# Altium project USRP2_Clone.PrjPcb (part 3 of 4)

## Sheet DB.SchDoc: {Наименование}
size 420 x 297 mm; DocumentNumber: ПЛАС.ХХХХХХ.ХХХ ХХ; SheetNumber: 7; SheetTotal: 11; PageSetup: Record=PageOptions|CenterHorizontal=False|CenterVertical=False|PrintScale=0.95|XCorrection=0.00|YCorrection=0.00|PrintKind=1|BorderSize=5000000|LeftOffset=0|BottomOffset=0|Orientation=1|PaperLength=1000|PaperWidth=1000|Scale=100|PaperSource=15|PrintQuality=600|MediaType=1|DitherType=10|PaperKind=A4|PrintScaleMode=1; Rule: PcbType=ProtelPcb
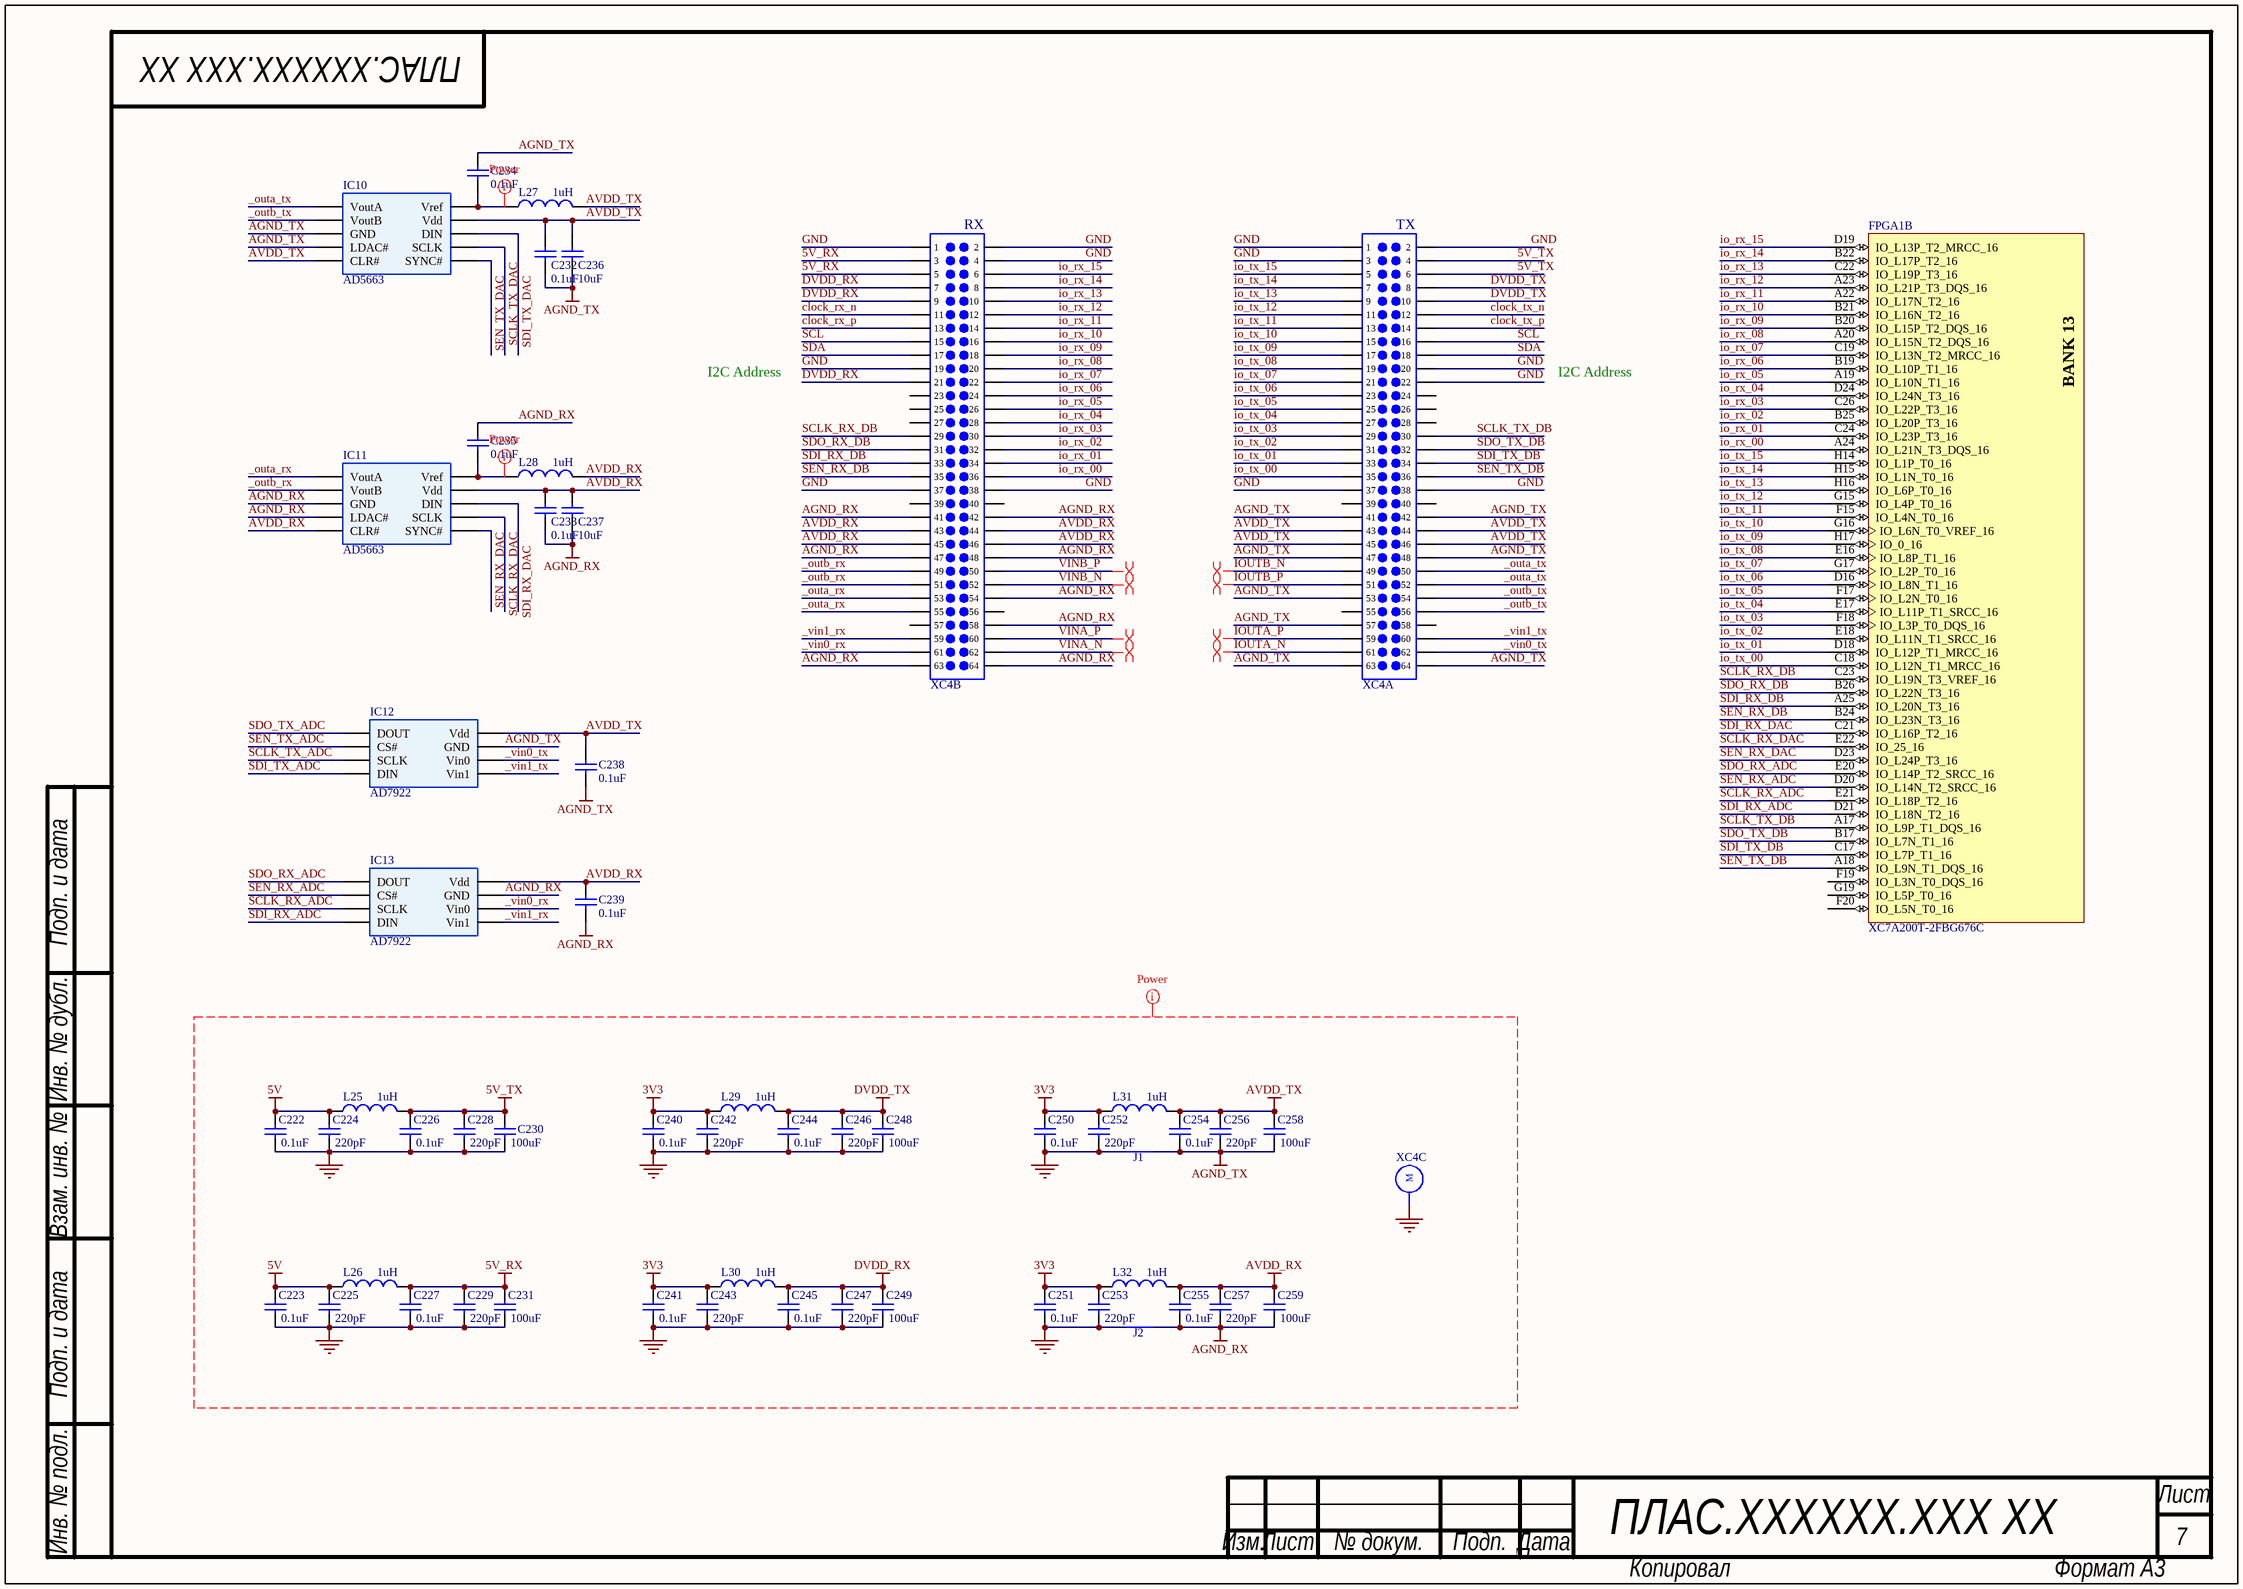
[diagram p6: DB.SchDoc]

### Parts
C222  value 0.1uF  [C0603]  (hidden comment: Cap)
C223  value 0.1uF  [C0603]  (hidden comment: Cap)
C224  value 220pF  [C0603]  (hidden comment: Cap)
C225  value 220pF  [C0603]  (hidden comment: Cap)
C226  value 0.1uF  [C0603]  (hidden comment: Cap)
C227  value 0.1uF  [C0603]  (hidden comment: Cap)
C228  value 220pF  [C0603]  (hidden comment: Cap)
C229  value 220pF  [C0603]  (hidden comment: Cap)
C230  value 100uF  [C1210]  (hidden comment: Cap)
C231  value 100uF  [C1210]  (hidden comment: Cap)
C232  value 0.1uF  [C0603]  (hidden comment: Cap)
C233  value 0.1uF  [C0603]  (hidden comment: Cap)
C234  value 0.1uF  [C0603]  (hidden comment: Cap)
C235  value 0.1uF  [C0603]  (hidden comment: Cap)
C236  value 10uF  [C0603]  (hidden comment: Cap)
C237  value 10uF  [C0603]  (hidden comment: Cap)
C238  value 0.1uF  [C0603]  (hidden comment: Cap)
C239  value 0.1uF  [C0603]  (hidden comment: Cap)
C240  value 0.1uF  [C0603]  (hidden comment: Cap)
C241  value 0.1uF  [C0603]  (hidden comment: Cap)
C242  value 220pF  [C0603]  (hidden comment: Cap)
C243  value 220pF  [C0603]  (hidden comment: Cap)
C244  value 0.1uF  [C0603]  (hidden comment: Cap)
C245  value 0.1uF  [C0603]  (hidden comment: Cap)
C246  value 220pF  [C0603]  (hidden comment: Cap)
C247  value 220pF  [C0603]  (hidden comment: Cap)
C248  value 100uF  [C1210]  (hidden comment: Cap)
C249  value 100uF  [C1210]  (hidden comment: Cap)
C250  value 0.1uF  [C0603]  (hidden comment: Cap)
C251  value 0.1uF  [C0603]  (hidden comment: Cap)
C252  value 220pF  [C0603]  (hidden comment: Cap)
C253  value 220pF  [C0603]  (hidden comment: Cap)
C254  value 0.1uF  [C0603]  (hidden comment: Cap)
C255  value 0.1uF  [C0603]  (hidden comment: Cap)
C256  value 220pF  [C0603]  (hidden comment: Cap)
C257  value 220pF  [C0603]  (hidden comment: Cap)
C258  value 100uF  [C1210]  (hidden comment: Cap)
C259  value 100uF  [C1210]  (hidden comment: Cap)
FPGA1  XC7A200T-2FBG676C  [FGG676]  (part B of 14)
IC10  AD5663  [MSOP-10]
IC11  AD5663  [MSOP-10]
IC12  AD7922  [MSOP-8]
IC13  AD7922  [MSOP-8]
J1  JMP  [JUMPER]  (value not drawn)  (net tie, no BOM)
J2  JMP  [JUMPER]  (value not drawn)  (net tie, no BOM)
L25  value 1uH  [L1210_Murata LQH]  (hidden comment: Inductor_LF)
L26  value 1uH  [L1210_Murata LQH]  (hidden comment: Inductor_LF)
L27  value 1uH  [L1206_Murata]  (hidden comment: Inductor_LF)
L28  value 1uH  [L1206_Murata]  (hidden comment: Inductor_LF)
L29  value 1uH  [L1210_Murata LQH]  (hidden comment: Inductor_LF)
L30  value 1uH  [L1210_Murata LQH]  (hidden comment: Inductor_LF)
L31  value 1uH  [L1210_Murata LQH]  (hidden comment: Inductor_LF)
L32  value 1uH  [L1210_Murata LQH]  (hidden comment: Inductor_LF)
XC4  64-pin Male Mezzanine  [RFX]  (value not drawn)  (parts A,B,C of 3)

### Nets
3V3: C240.1 C241.1 C242.1 C243.1 C250.1 C251.1 C252.1 C253.1 L29.2 L30.2 L31.1 L32.1
5V: C222.1 C223.1 C224.1 C225.1 L25.1 L26.2
5V_RX: C227.1 C229.1 C231.1 L26.1 XC4.67(3) XC4.69(5)
5V_TX: C226.1 C228.1 C230.1 L25.2 XC4.4 XC4.6
AGND_RX: C233.2 C235.1 C237.2 C239.2 C255.2 C257.2 C259.2 IC11.3(GND) IC11.4(LDAC#) IC13.7(GND) J2.2 XC4.105(41) XC4.106(42) XC4.111(47) XC4.112(48) XC4.118(54) XC4.122(58) XC4.127(63) XC4.128(64)
AGND_TX: C232.2 C234.1 C236.2 C238.1 C254.2 C256.2 C258.2 IC10.3(GND) IC10.4(LDAC#) IC12.7(GND) J1.2 XC4.41 XC4.42 XC4.47 XC4.48 XC4.53 XC4.57 XC4.63 XC4.64
AVDD_RX: C233.1 C237.1 C239.1 C255.1 C257.1 C259.1 IC11.5(CLR#) IC11.9(Vdd) IC13.8(Vdd) L28.1 L32.2 XC4.107(43) XC4.108(44) XC4.109(45) XC4.110(46)
AVDD_TX: C232.1 C236.1 C238.2 C254.1 C256.1 C258.1 IC10.5(CLR#) IC10.9(Vdd) IC12.8(Vdd) L27.1 L31.2 XC4.43 XC4.44 XC4.45 XC4.46
DVDD_RX: C245.1 C247.1 C249.1 L30.1 XC4.71(7) XC4.73(9) XC4.85(21)
DVDD_TX: C244.1 C246.1 C248.1 L29.1 XC4.8 XC4.10
GND: C222.2 C223.2 C224.2 C225.2 C226.2 C227.2 C228.2 C229.2 C230.2 C231.2 C240.2 C241.2 C242.2 C243.2 C244.2 C245.2 C246.2 C247.2 C248.2 C249.2 C250.2 C251.2 C252.2 C253.2 J1.1 J2.1 XC4.0(M) XC4.1 XC4.2 XC4.3 XC4.20 XC4.22 XC4.37 XC4.38 XC4.65(1) XC4.66(2) XC4.68(4) XC4.83(19) XC4.101(37) XC4.102(38)
_outa_rx: IC11.1(VoutA) XC4.117(53) XC4.119(55)
_outa_tx: IC10.1(VoutA) XC4.50 XC4.52
_outb_rx: IC11.2(VoutB) XC4.113(49) XC4.115(51)
_outb_tx: IC10.2(VoutB) XC4.54 XC4.56
_vin0_rx: IC13.6(Vin0) XC4.125(61)
_vin0_tx: IC12.6(Vin0) XC4.62
_vin1_rx: IC13.5(Vin1) XC4.123(59)
_vin1_tx: IC12.5(Vin1) XC4.60
clock_rx_n: XC4.75(11)
clock_rx_p: XC4.77(13)
clock_tx_n: XC4.12
clock_tx_p: XC4.14
io_rx_00: FPGA1.A24(IO_L21N_T3_DQS_16) XC4.100(36)
io_rx_01: FPGA1.C24(IO_L23P_T3_16) XC4.98(34)
io_rx_02: FPGA1.B25(IO_L20P_T3_16) XC4.96(32)
io_rx_03: FPGA1.C26(IO_L22P_T3_16) XC4.94(30)
io_rx_04: FPGA1.D24(IO_L24N_T3_16) XC4.92(28)
io_rx_05: FPGA1.A19(IO_L10N_T1_16) XC4.90(26)
io_rx_06: FPGA1.B19(IO_L10P_T1_16) XC4.88(24)
io_rx_07: FPGA1.C19(IO_L13N_T2_MRCC_16) XC4.86(22)
io_rx_08: FPGA1.A20(IO_L15N_T2_DQS_16) XC4.84(20)
io_rx_09: FPGA1.B20(IO_L15P_T2_DQS_16) XC4.82(18)
io_rx_10: FPGA1.B21(IO_L16N_T2_16) XC4.80(16)
io_rx_11: FPGA1.A22(IO_L17N_T2_16) XC4.78(14)
io_rx_12: FPGA1.A23(IO_L21P_T3_DQS_16) XC4.76(12)
io_rx_13: FPGA1.C22(IO_L19P_T3_16) XC4.74(10)
io_rx_14: FPGA1.B22(IO_L17P_T2_16) XC4.72(8)
io_rx_15: FPGA1.D19(IO_L13P_T2_MRCC_16) XC4.70(6)
io_tx_00: FPGA1.C18(IO_L12N_T1_MRCC_16) XC4.35
io_tx_01: FPGA1.D18(IO_L12P_T1_MRCC_16) XC4.33
io_tx_02: FPGA1.E18(IO_L11N_T1_SRCC_16) XC4.31
io_tx_03: FPGA1.F18(IO_L3P_T0_DQS_16) XC4.29
io_tx_04: FPGA1.E17(IO_L11P_T1_SRCC_16) XC4.27
io_tx_05: FPGA1.F17(IO_L2N_T0_16) XC4.25
io_tx_06: FPGA1.D16(IO_L8N_T1_16) XC4.23
io_tx_07: FPGA1.G17(IO_L2P_T0_16) XC4.21
io_tx_08: FPGA1.E16(IO_L8P_T1_16) XC4.19
io_tx_09: FPGA1.H17(IO_0_16) XC4.17
io_tx_10: FPGA1.G16(IO_L6N_T0_VREF_16) XC4.15
io_tx_11: FPGA1.F15(IO_L4N_T0_16) XC4.13
io_tx_12: FPGA1.G15(IO_L4P_T0_16) XC4.11
io_tx_13: FPGA1.H16(IO_L6P_T0_16) XC4.9
io_tx_14: FPGA1.H15(IO_L1N_T0_16) XC4.7
io_tx_15: FPGA1.H14(IO_L1P_T0_16) XC4.5
IOUTA_N: XC4.61
IOUTA_P: XC4.59
IOUTB_N: XC4.49
IOUTB_P: XC4.51
SCL: XC4.16 XC4.79(15)
SCLK_RX_ADC: FPGA1.E21(IO_L18P_T2_16) IC13.3(SCLK)
SCLK_RX_DAC: FPGA1.E22(IO_25_16) IC11.7(SCLK)
SCLK_RX_DB: FPGA1.C23(IO_L19N_T3_VREF_16) XC4.93(29)
SCLK_TX_ADC: IC12.3(SCLK)
SCLK_TX_DAC: IC10.7(SCLK)
SCLK_TX_DB: FPGA1.A17(IO_L9P_T1_DQS_16) XC4.30
SDA: XC4.18 XC4.81(17)
SDI_RX_ADC: FPGA1.D21(IO_L18N_T2_16) IC13.4(DIN)
SDI_RX_DAC: FPGA1.C21(IO_L16P_T2_16) IC11.8(DIN)
SDI_RX_DB: FPGA1.A25(IO_L20N_T3_16) XC4.97(33)
SDI_TX_ADC: IC12.4(DIN)
SDI_TX_DAC: IC10.8(DIN)
SDI_TX_DB: FPGA1.C17(IO_L7P_T1_16) XC4.34
SDO_RX_ADC: FPGA1.E20(IO_L14P_T2_SRCC_16) IC13.1(DOUT)
SDO_RX_DB: FPGA1.B26(IO_L22N_T3_16) XC4.95(31)
SDO_TX_ADC: IC12.1(DOUT)
SDO_TX_DB: FPGA1.B17(IO_L7N_T1_16) XC4.32
SEN_RX_ADC: FPGA1.D20(IO_L14N_T2_SRCC_16) IC13.2(CS#)
SEN_RX_DAC: FPGA1.D23(IO_L24P_T3_16) IC11.6(SYNC#)
SEN_RX_DB: FPGA1.B24(IO_L23N_T3_16) XC4.99(35)
SEN_TX_ADC: IC12.2(CS#)
SEN_TX_DAC: IC10.6(SYNC#)
SEN_TX_DB: FPGA1.A18(IO_L9N_T1_DQS_16) XC4.36
VINA_N: XC4.126(62)
VINA_P: XC4.124(60)
VINB_N: XC4.116(52)
VINB_P: XC4.114(50)
NetC234_2: C234.2 IC10.10(Vref) L27.2
NetC235_2: C235.2 IC11.10(Vref) L28.2

Not connected (* = marked no-connect by the designer): FPGA1 F19(IO_L3N_T0_DQS_16) F20(IO_L5N_T0_16) G19(IO_L5P_T0_16); XC4 24 26 28 39 40 55 58 87(23) 89(25) 91(27) 103(39) 104(40) 120(56) 121(57)

### Layout directives
net class Power: 3V3, 5V, 5V_RX, 5V_TX, AGND_RX, AGND_TX, AVDD_RX, AVDD_TX, DVDD_RX, DVDD_TX, GND, NetC234_2, NetC235_2
differential pair: IOUTA_N, IOUTA_P, IOUTB_N, IOUTB_P, VINA_N, VINA_P, VINB_N, VINB_P

### Notes on the sheet
- I2C Address
- Подп. и дата
- Инв. № дубл.
- Взам. инв. №
- Инв. № подл.
- Лист
- Изм.
- № докум.
- Подп.
- Дата
- Копировал
- Формат А3
- (in symbol RFX, part A) TX
- (in symbol RFX, part B) RX
- (in symbol XC7A200T-2FBG676C, part B) BANK 13

### Library data of the parts
C222-C229 C232-C235 C238-C247 C250-C257 = Cer Cap: as C263 on sheet Clocking; PackageReference: SMD Chip Capacitor; Package: 0603
C230 C231 C248 C249 C258 C259 = Cap uF: as C295 on sheet Clocking; Package: C1210; PackageDescription: SMD Chip Capacitor
C236 C237 = Cer Cap: Cer Cap Small; Manufacturer: Murata; Material: x5r; Voltage: 6.3V; Tolerance: 10%; Type: Ceramic; PackageReference: SMD Chip Capacitor; Package: 0603
FPGA1 = XC7A200T-2FBG676C: as FPGA1 on sheet JTAG; DatasheetVersion: v1.12; PackageVersion: Rev 1.8; PackageReference: FBG676; PackageDescription: Flip-Chip Lidless BGA, Body 27 x 27 mm, 1.0 mm Pitch; Supplier 1: Digi-Key; Supplier Part Number 1: 122-1865-ND; CLBs (Max Distributed RAM Kb): 2888; Generic Part Number: XC7A200T; RoHS: Pb-Free; NexusDeviceID: XC7A200T-2FBG676C; Mounting Technology: Surface Mount; Code_JEDEC: MS-034; PartNumber: XC7A200T-2FBG676C; ComponentLink1Description: Manufacturer URL; ComponentLink1URL: http://www.xilinx.com/; ComponentLink2Description: Datasheet; ComponentLink2URL: http://www.xilinx.com/support/documentation/data_sheets/ds180_7Series_Overview.pdf; ComponentLink3Description: Package Specification; ComponentLink3URL: http://www.xilinx.com/support/documentation/user_guides/ug475_7Series_Pkg_Pinout.pdf; ComponentLink4Description: DC and Switching Characteristics; ComponentLink4URL: http://www.xilinx.com/support/documentation/data_sheets/ds181_Artix_7_Data_Sheet.pdf; ComponentLink5Description: Package File; ComponentLink5URL: http://www.xilinx.com/support/packagefiles/a7packages/xc7a200tfbg676pkg.txt; ComponentLink6Description: Packaging and Pinout; ComponentLink6URL: http://www.xilinx.com/support/documentation/user_guides/ug475_7Series_Pkg_Pinout.pdf
IC10 IC11 = AD56x3R: Dual 12-/14-/16-Bit nanoDAC; Manufacturer: Analog Device; Name: AD5663RBRMZ-5; settling time: 4.5 μs maximum; Voltage: 2.7 V to 5.5 V; High speed serial interface: SPI®/QSPI™/MICROWIRE™/DSP compatible; Type: Dual 12-/14-/16-Bit nanoDAC with 5 ppm/°C On-Chip Reference; Package: MSOP-10
IC12 IC13 = AD79x2: 1 MSPS, 10-/12-Bit ADC; Manufacturer: Analog Device; Name: AD7922ARM; Fast throughput rate: 1MHz; Voltage: 2.35 V to 5.25 V; High speed serial interface: SPI®/QSPI™/MICROWIRE™/DSP compatible; Type: 2-Channel, 2.35 V to 5.25 V,1 MSPS, 10-/12-Bit ADC; Package: MSOP-8
J1 J2 = JMP: PGND & AGND Connect; Rule: UNIONINDEX{}0[]RULEKIND{}Width[]NETSCOPE{}AnyNet[]LAYERKIND{}SameLayer[]NAME{}Schematic Width Constraint[]MAXLIMIT{}59.0551mil[]MINLIMIT{}10mil[]PREFEREDWIDTH{}10mil[]MIDLAYER5_MAXWIDTH{}19.685mil[]MIDLAYER6_MAXWIDTH{}19.685mil[]MIDLAYER7_MAXWIDTH{}19.685mil[]MIDLAYER8_MAXWIDTH{}19.685mil[]MIDLAYER9_MAXWIDTH{}19.685mil[]MIDLAYER10_MAXWIDTH{}19.685mil[]MIDLAYER11_MAXWIDTH{}19.685mil[]MIDLAYER12_MAXWIDTH{}19.685mil[]MIDLAYER13_MAXWIDTH{}19.685mil[]MIDLAYER14_MAXWIDTH{}19.685mil[]MIDLAYER15_MAXWIDTH{}19.685mil[]MIDLAYER16_MAXWIDTH{}19.685mil[]MIDLAYER17_MAXWIDTH{}19.685mil[]MIDLAYER18_MAXWIDTH{}19.685mil[]MIDLAYER19_MAXWIDTH{}19.685mil[]MIDLAYER20_MAXWIDTH{}19.685mil[]MIDLAYER21_MAXWIDTH{}19.685mil[]MIDLAYER22_MAXWIDTH{}19.685mil[]MIDLAYER23_MAXWIDTH{}19.685mil[]MIDLAYER24_MAXWIDTH{}19.685mil[]MIDLAYER25_MAXWIDTH{}19.685mil[]MIDLAYER26_MAXWIDTH{}19.685mil[]MIDLAYER27_MAXWIDTH{}19.685mil[]MIDLAYER28_MAXWIDTH{}19.685mil[]MIDLAYER29_MAXWIDTH{}19.685mil[]MIDLAYER30_MAXWIDTH{}19.685mil[]MINIMP{}50.000000[]MAXIMP{}50.000000[]FAVIMP{}50.000000[]UNIT{}Metric[]PcbType{}ProtelPcb
L25 L26 L29-L32 = Inductor_LF: Inductor_Power_Lines; Manufacturer: Murata; Name: LQH32PN1R0NNC; Tolerance: 5%; Current: 2500mA; Frequency: 100MHz; Package: 1210; PackageDescription: Chip Inductor; Temperature Range: -25…85; Series: LQH
L27 L28 = Inductor_LF: Inductor_Power_Lines; Manufacturer: Murata; Name: LQM31PN1R0M00; Tolerance: 5%; Current: 1200mA; Frequency: 60MHz; Package: 1206; PackageDescription: Chip Inductor; Temperature Range: -25…85; Series: LQM
XC4 = RFX: Name: 1.00mm Pitch Mezzanine 714362164

## Sheet FPGA&CODECS.SchDoc: {Наименование}
size 420 x 297 mm; DocumentNumber: ПЛАС.ХХХХХХ.ХХХ ХХ; SheetNumber: 8; SheetTotal: 11; PageSetup: Record=PageOptions|CenterHorizontal=False|CenterVertical=False|PrintScale=0.95|XCorrection=0.00|YCorrection=0.00|PrintKind=1|BorderSize=5000000|LeftOffset=0|BottomOffset=0|Orientation=1|PaperLength=1000|PaperWidth=1000|Scale=100|PaperSource=15|PrintQuality=600|MediaType=1|DitherType=10|PaperKind=A4|PrintScaleMode=1; Rule: PcbType=ProtelPcb
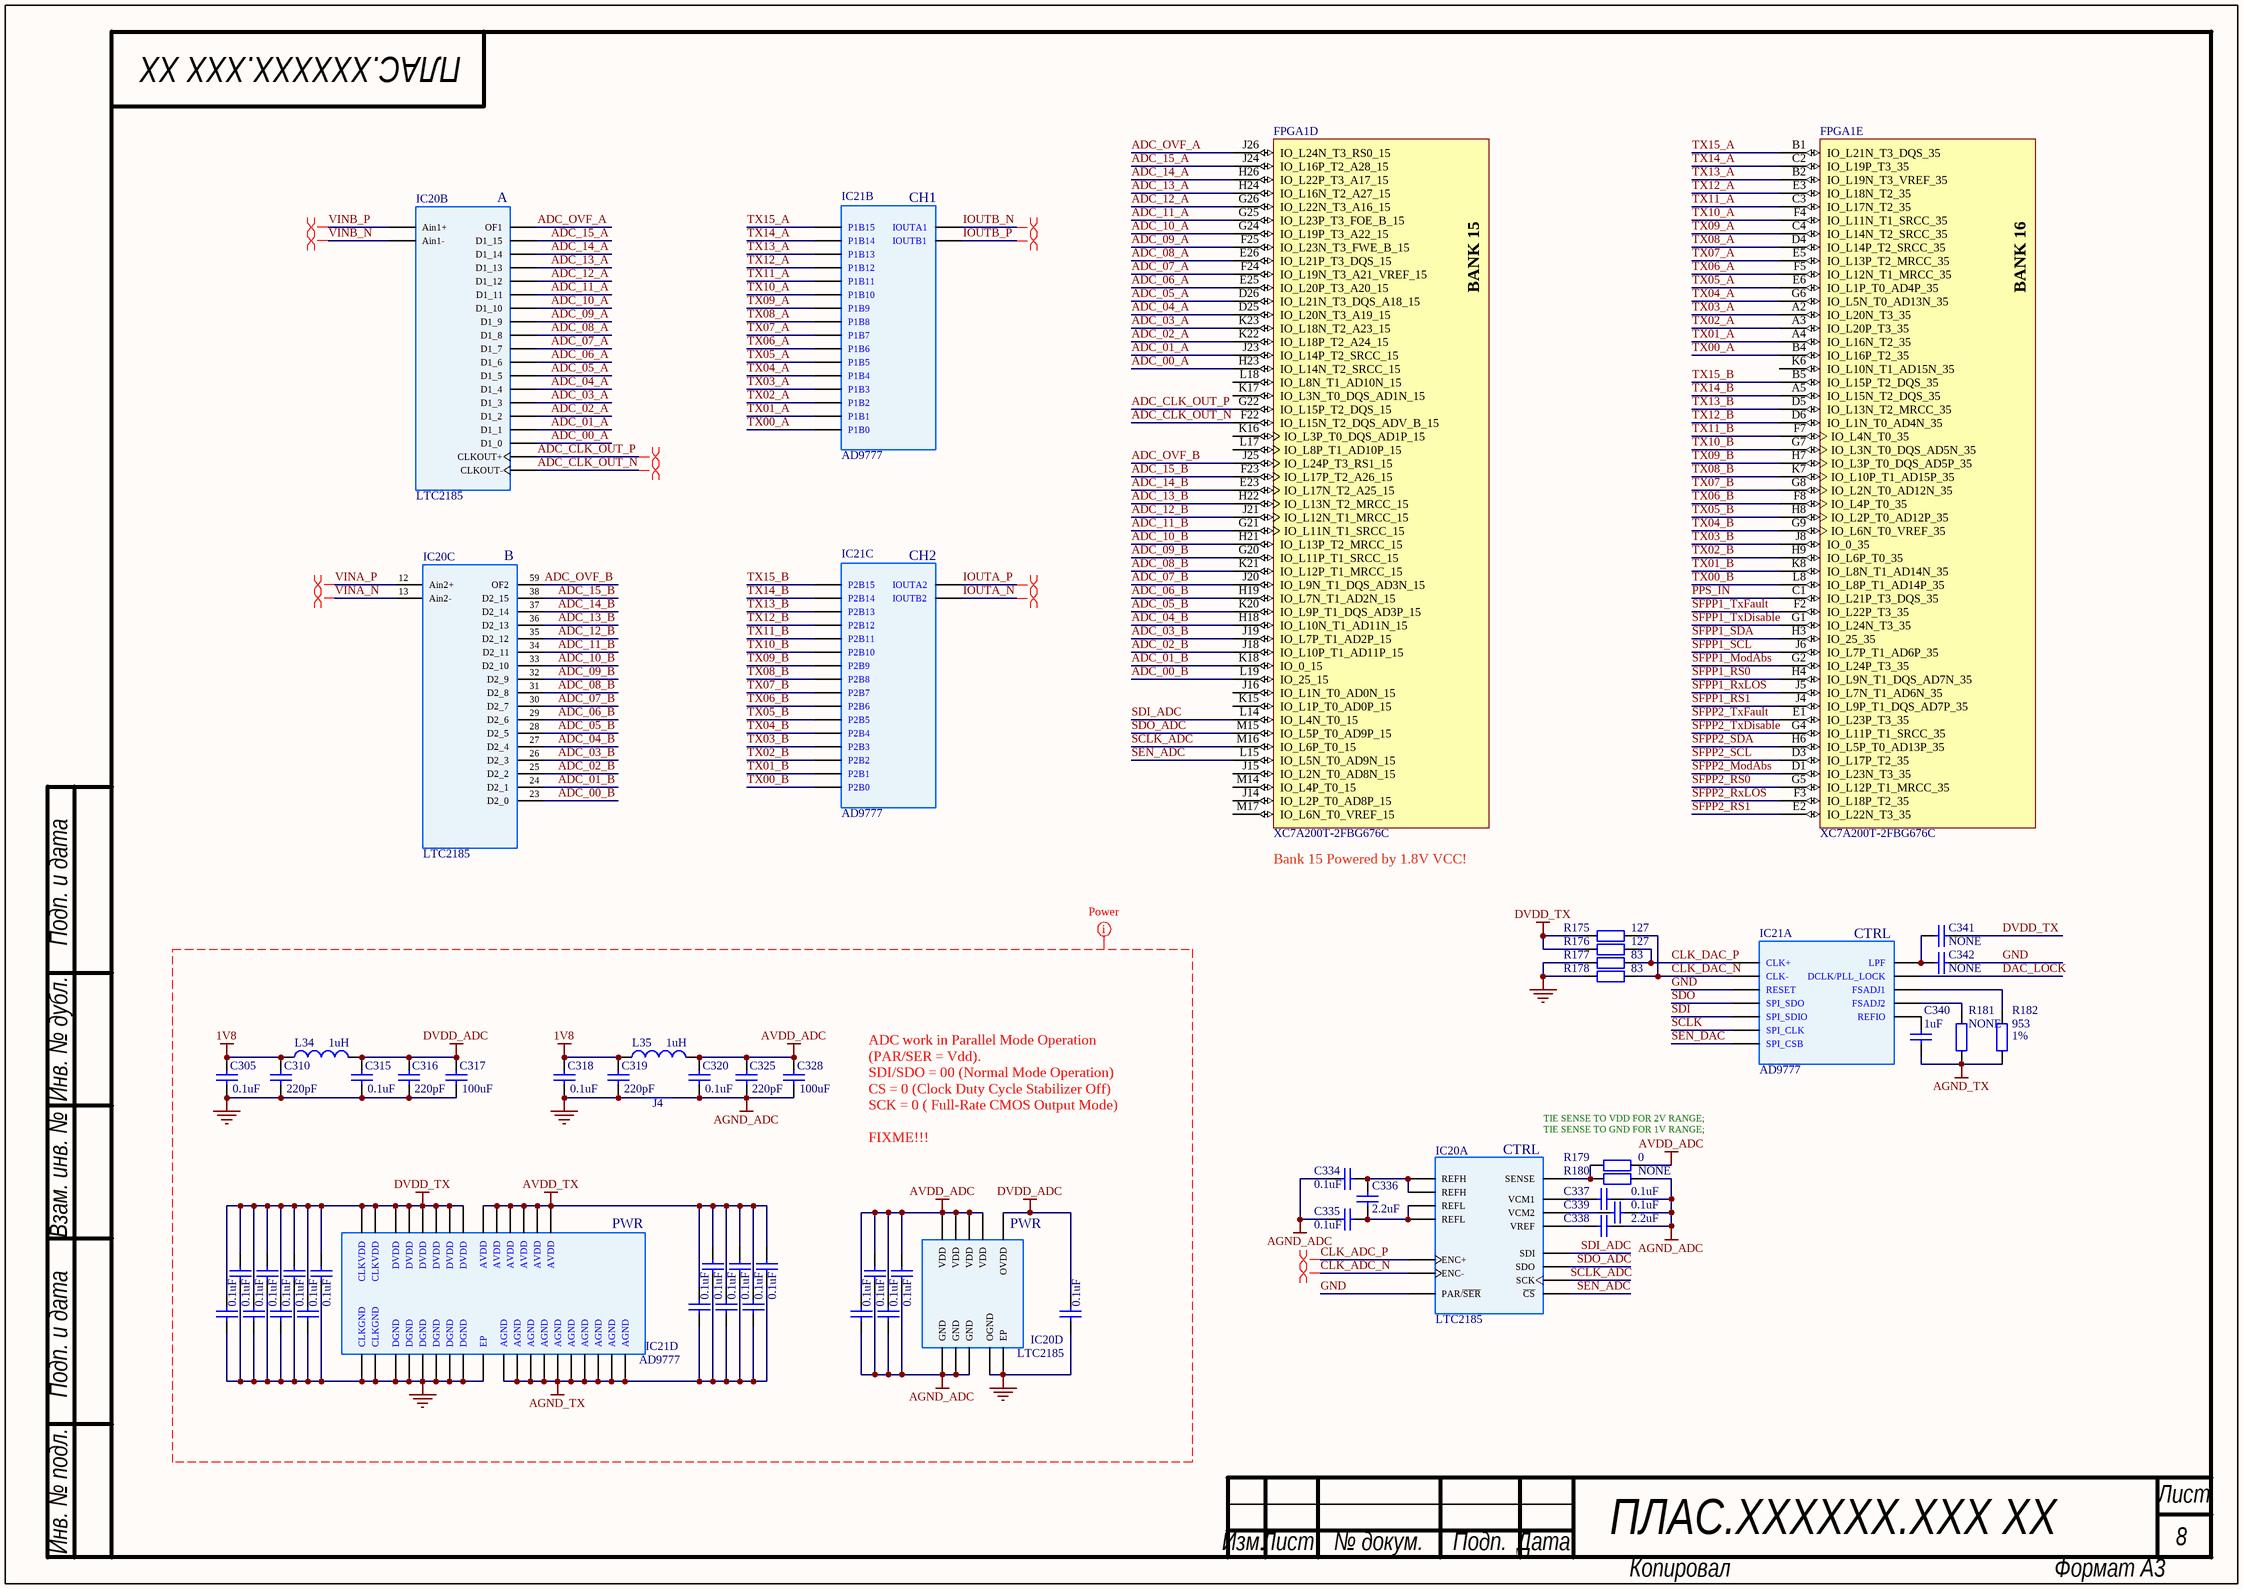
[diagram p7: FPGA&CODECS.SchDoc]

### Parts
C305  value 0.1uF  [C0603]  (hidden comment: Cap)
C306  value 0.1uF  [С0402]  (hidden comment: Cap)
C307  value 0.1uF  [С0402]  (hidden comment: Cap)
C308  value 0.1uF  [С0402]  (hidden comment: Cap)
C309  value 0.1uF  [С0402]  (hidden comment: Cap)
C310  value 220pF  [C0603]  (hidden comment: Cap)
C311  value 0.1uF  [С0402]  (hidden comment: Cap)
C312  value 0.1uF  [С0402]  (hidden comment: Cap)
C313  value 0.1uF  [С0402]  (hidden comment: Cap)
C314  value 0.1uF  [С0402]  (hidden comment: Cap)
C315  value 0.1uF  [C0603]  (hidden comment: Cap)
C316  value 220pF  [C0603]  (hidden comment: Cap)
C317  value 100uF  [C1210]  (hidden comment: Cap)
C318  value 0.1uF  [C0603]  (hidden comment: Cap)
C319  value 220pF  [C0603]  (hidden comment: Cap)
C320  value 0.1uF  [C0603]  (hidden comment: Cap)
C321  value 0.1uF  [С0402]  (hidden comment: Cap)
C322  value 0.1uF  [С0402]  (hidden comment: Cap)
C323  value 0.1uF  [С0402]  (hidden comment: Cap)
C324  value 0.1uF  [С0402]  (hidden comment: Cap)
C325  value 220pF  [C0603]  (hidden comment: Cap)
C326  value 0.1uF  [С0402]  (hidden comment: Cap)
C327  value 0.1uF  [С0402]  (hidden comment: Cap)
C328  value 100uF  [C1210]  (hidden comment: Cap)
C329  value 0.1uF  [С0402]  (hidden comment: Cap)
C330  value 0.1uF  [С0402]  (hidden comment: Cap)
C331  value 0.1uF  [С0402]  (hidden comment: Cap)
C332  value 0.1uF  [С0402]  (hidden comment: Cap)
C333  value 0.1uF  [С0402]  (hidden comment: Cap)
C334  value 0.1uF  [С0402]  (hidden comment: Cap)
C335  value 0.1uF  [С0402]  (hidden comment: Cap)
C336  value 2.2uF  [C0603]  (hidden comment: Cap)
C337  value 0.1uF  [С0402]  (hidden comment: Cap)
C338  value 2.2uF  [C0603]  (hidden comment: Cap)
C339  value 0.1uF  [С0402]  (hidden comment: Cap)
C340  value 1uF  [С0402]  (hidden comment: Cap)
C341  value NONE  [С0402]  (hidden comment: Cap)
C342  value NONE  [С0402]  (hidden comment: Cap)
FPGA1  XC7A200T-2FBG676C  [FGG676]  (parts D,E of 14)
IC20  LTC2185  [QFN-64]  (parts A,B,C,D of 4)
IC21  AD9777  [TQFP-80-EP]  (parts A,B,C,D of 4)
J4  JMP  [JUMPER]  (value not drawn)  (net tie, no BOM)
L34  value 1uH  [L1210_Murata LQH]  (hidden comment: Inductor_LF)
L35  value 1uH  [L1210_Murata LQH]  (hidden comment: Inductor_LF)
R175  value 127  [R0402]  (hidden comment: Res)
R176  value 127  [R0402]  (hidden comment: Res)
R177  value 83  [R0402]  (hidden comment: Res)
R178  value 83  [R0402]  (hidden comment: Res)
R179  value 0  [R0402]  (hidden comment: Res)
R180  value NONE  [R0402]  (hidden comment: Res)
R181  value NONE  [R0402]  (hidden comment: Res)
R182  value 953  Tolerance: 1%  [R0402]  (hidden comment: Res)

### Nets
1V8: C305.1 C310.1 C318.1 C319.1 L34.2 L35.1
AGND_ADC: C320.2 C325.2 C328.2 C329.1 C330.1 C331.1 C332.1 C334.1 C335.2 C337.2 C338.1 C339.1 IC20.3(GND) IC20.6(GND) IC20.14(GND) J4.2 R180.2
AGND_TX: C321.1 C322.1 C323.1 C324.1 C326.1 C327.1 C340.2 IC21.62(AGND) IC21.64(AGND) IC21.66(AGND) IC21.67(AGND) IC21.70(AGND) IC21.71(AGND) IC21.74(AGND) IC21.75(AGND) IC21.77(AGND) IC21.79(AGND) R181.2 R182.2
AVDD_ADC: C320.1 C325.1 C328.1 C329.2 C330.2 C331.2 C332.2 IC20.1(VDD) IC20.16(VDD) IC20.17(VDD) IC20.64(VDD) L35.2 R179.1
AVDD_TX: C321.2 C322.2 C323.2 C324.2 C326.2 C327.2 IC21.61(AVDD) IC21.63(AVDD) IC21.65(AVDD) IC21.76(AVDD) IC21.78(AVDD) IC21.80(AVDD)
DVDD_ADC: C315.1 C316.1 C317.1 C333.2 IC20.42(OVDD) L34.1
DVDD_TX: C306.2 C307.2 C308.2 C309.2 C311.2 C312.1 C313.2 C314.1 C341.2 IC21.1(CLKVDD) IC21.3(CLKVDD) IC21.10(DVDD) IC21.18(DVDD) IC21.26(DVDD) IC21.36(DVDD) IC21.43(DVDD) IC21.51(DVDD) R175.2 R176.2
GND: C305.2 C306.1 C307.1 C308.1 C309.1 C310.2 C311.1 C312.2 C313.1 C314.2 C315.2 C316.2 C317.2 C318.2 C319.2 C333.1 C342.1 IC20.0(EP) IC20.11(PAR/~{SER}) IC20.41(OGND) IC21.0(EP) IC21.4(CLKGND) IC21.7(CLKGND) IC21.9(DGND) IC21.17(DGND) IC21.25(DGND) IC21.35(DGND) IC21.44(DGND) IC21.52(DGND) IC21.57(RESET) J4.1 R177.2 R178.2
ADC_00_A: FPGA1.H23(IO_L14N_T2_SRCC_15) IC20.43(D1_0)
ADC_00_B: FPGA1.L19(IO_25_15) IC20.23(D2_0)
ADC_01_A: FPGA1.J23(IO_L14P_T2_SRCC_15) IC20.44(D1_1)
ADC_01_B: FPGA1.K18(IO_0_15) IC20.24(D2_1)
ADC_02_A: FPGA1.K22(IO_L18P_T2_A24_15) IC20.45(D1_2)
ADC_02_B: FPGA1.J18(IO_L10P_T1_AD11P_15) IC20.25(D2_2)
ADC_03_A: FPGA1.K23(IO_L18N_T2_A23_15) IC20.46(D1_3)
ADC_03_B: FPGA1.J19(IO_L7P_T1_AD2P_15) IC20.26(D2_3)
ADC_04_A: FPGA1.D25(IO_L20N_T3_A19_15) IC20.47(D1_4)
ADC_04_B: FPGA1.H18(IO_L10N_T1_AD11N_15) IC20.27(D2_4)
ADC_05_A: FPGA1.D26(IO_L21N_T3_DQS_A18_15) IC20.48(D1_5)
ADC_05_B: FPGA1.K20(IO_L9P_T1_DQS_AD3P_15) IC20.28(D2_5)
ADC_06_A: FPGA1.E25(IO_L20P_T3_A20_15) IC20.49(D1_6)
ADC_06_B: FPGA1.H19(IO_L7N_T1_AD2N_15) IC20.29(D2_6)
ADC_07_A: FPGA1.F24(IO_L19N_T3_A21_VREF_15) IC20.50(D1_7)
ADC_07_B: FPGA1.J20(IO_L9N_T1_DQS_AD3N_15) IC20.30(D2_7)
ADC_08_A: FPGA1.E26(IO_L21P_T3_DQS_15) IC20.51(D1_8)
ADC_08_B: FPGA1.K21(IO_L12P_T1_MRCC_15) IC20.31(D2_8)
ADC_09_A: FPGA1.F25(IO_L23N_T3_FWE_B_15) IC20.52(D1_9)
ADC_09_B: FPGA1.G20(IO_L11P_T1_SRCC_15) IC20.32(D2_9)
ADC_10_A: FPGA1.G24(IO_L19P_T3_A22_15) IC20.53(D1_10)
ADC_10_B: FPGA1.H21(IO_L13P_T2_MRCC_15) IC20.33(D2_10)
ADC_11_A: FPGA1.G25(IO_L23P_T3_FOE_B_15) IC20.54(D1_11)
ADC_11_B: FPGA1.G21(IO_L11N_T1_SRCC_15) IC20.34(D2_11)
ADC_12_A: FPGA1.G26(IO_L22N_T3_A16_15) IC20.55(D1_12)
ADC_12_B: FPGA1.J21(IO_L12N_T1_MRCC_15) IC20.35(D2_12)
ADC_13_A: FPGA1.H24(IO_L16N_T2_A27_15) IC20.56(D1_13)
ADC_13_B: FPGA1.H22(IO_L13N_T2_MRCC_15) IC20.36(D2_13)
ADC_14_A: FPGA1.H26(IO_L22P_T3_A17_15) IC20.57(D1_14)
ADC_14_B: FPGA1.E23(IO_L17N_T2_A25_15) IC20.37(D2_14)
ADC_15_A: FPGA1.J24(IO_L16P_T2_A28_15) IC20.58(D1_15)
ADC_15_B: FPGA1.F23(IO_L17P_T2_A26_15) IC20.38(D2_15)
ADC_CLK_OUT_N: FPGA1.F22(IO_L15N_T2_DQS_ADV_B_15) IC20.39(CLKOUT-)
ADC_CLK_OUT_P: FPGA1.G22(IO_L15P_T2_DQS_15) IC20.40(CLKOUT+)
ADC_OVF_A: FPGA1.J26(IO_L24N_T3_RS0_15) IC20.60(OF1)
ADC_OVF_B: FPGA1.J25(IO_L24P_T3_RS1_15) IC20.59(OF2)
CLK_ADC_N: IC20.19(ENC-)
CLK_ADC_P: IC20.18(ENC+)
CLK_DAC_N: IC21.6(CLK-) R175.1 R178.1
CLK_DAC_P: IC21.5(CLK+) R176.1 R177.1
DAC_LOCK: IC21.8(DCLK/PLL_LOCK)
IOUTA_N: IC21.68(IOUTB2)
IOUTA_P: IC21.69(IOUTA2)
IOUTB_N: IC21.73(IOUTA1)
IOUTB_P: IC21.72(IOUTB1)
PPS_IN: FPGA1.C1(IO_L21P_T3_DQS_35)
SCLK: IC21.55(SPI_CLK)
SCLK_ADC: FPGA1.M16(IO_L6P_T0_15) IC20.21(SCK)
SDI: IC21.54(SPI_SDIO)
SDI_ADC: FPGA1.L14(IO_L4N_T0_15) IC20.22(SDI)
SDO: IC21.53(SPI_SDO)
SDO_ADC: FPGA1.M15(IO_L5P_T0_AD9P_15) IC20.61(SDO)
SEN_ADC: FPGA1.L15(IO_L5N_T0_AD9N_15) IC20.20(~{CS})
SEN_DAC: IC21.56(SPI_CSB)
SFPP1_ModAbs: FPGA1.G2(IO_L24P_T3_35)
SFPP1_RS0: FPGA1.H4(IO_L9N_T1_DQS_AD7N_35)
SFPP1_RS1: FPGA1.J4(IO_L9P_T1_DQS_AD7P_35)
SFPP1_RxLOS: FPGA1.J5(IO_L7N_T1_AD6N_35)
SFPP1_SCL: FPGA1.J6(IO_L7P_T1_AD6P_35)
SFPP1_SDA: FPGA1.H3(IO_25_35)
SFPP1_TxDisable: FPGA1.G1(IO_L24N_T3_35)
SFPP1_TxFault: FPGA1.F2(IO_L22P_T3_35)
SFPP2_ModAbs: FPGA1.D1(IO_L23N_T3_35)
SFPP2_RS0: FPGA1.G5(IO_L12P_T1_MRCC_35)
SFPP2_RS1: FPGA1.E2(IO_L22N_T3_35)
SFPP2_RxLOS: FPGA1.F3(IO_L18P_T2_35)
SFPP2_SCL: FPGA1.D3(IO_L17P_T2_35)
SFPP2_SDA: FPGA1.H6(IO_L5P_T0_AD13P_35)
SFPP2_TxDisable: FPGA1.G4(IO_L11P_T1_SRCC_35)
SFPP2_TxFault: FPGA1.E1(IO_L23P_T3_35)
TX00_A: FPGA1.B4(IO_L16P_T2_35) IC21.30(P1B0)
TX00_B: FPGA1.L8(IO_L8P_T1_AD14P_35) IC21.50(P2B0)
TX01_A: FPGA1.A4(IO_L16N_T2_35) IC21.29(P1B1)
TX01_B: FPGA1.K8(IO_L8N_T1_AD14N_35) IC21.49(P2B1)
TX02_A: FPGA1.A3(IO_L20P_T3_35) IC21.28(P1B2)
TX02_B: FPGA1.H9(IO_L6P_T0_35) IC21.48(P2B2)
TX03_A: FPGA1.A2(IO_L20N_T3_35) IC21.27(P1B3)
TX03_B: FPGA1.J8(IO_0_35) IC21.47(P2B3)
TX04_A: FPGA1.G6(IO_L5N_T0_AD13N_35) IC21.24(P1B4)
TX04_B: FPGA1.G9(IO_L6N_T0_VREF_35) IC21.46(P2B4)
TX05_A: FPGA1.E6(IO_L1P_T0_AD4P_35) IC21.23(P1B5)
TX05_B: FPGA1.H8(IO_L2P_T0_AD12P_35) IC21.45(P2B5)
TX06_A: FPGA1.F5(IO_L12N_T1_MRCC_35) IC21.22(P1B6)
TX06_B: FPGA1.F8(IO_L4P_T0_35) IC21.42(P2B6)
TX07_A: FPGA1.E5(IO_L13P_T2_MRCC_35) IC21.21(P1B7)
TX07_B: FPGA1.G8(IO_L2N_T0_AD12N_35) IC21.41(P2B7)
TX08_A: FPGA1.D4(IO_L14P_T2_SRCC_35) IC21.20(P1B8)
TX08_B: FPGA1.K7(IO_L10P_T1_AD15P_35) IC21.40(P2B8)
TX09_A: FPGA1.C4(IO_L14N_T2_SRCC_35) IC21.19(P1B9)
TX09_B: FPGA1.H7(IO_L3P_T0_DQS_AD5P_35) IC21.39(P2B9)
TX10_A: FPGA1.F4(IO_L11N_T1_SRCC_35) IC21.16(P1B10)
TX10_B: FPGA1.G7(IO_L3N_T0_DQS_AD5N_35) IC21.38(P2B10)
TX11_A: FPGA1.C3(IO_L17N_T2_35) IC21.15(P1B11)
TX11_B: FPGA1.F7(IO_L4N_T0_35) IC21.37(P2B11)
TX12_A: FPGA1.E3(IO_L18N_T2_35) IC21.14(P1B12)
TX12_B: FPGA1.D6(IO_L1N_T0_AD4N_35) IC21.34(P2B12)
TX13_A: FPGA1.B2(IO_L19N_T3_VREF_35) IC21.13(P1B13)
TX13_B: FPGA1.D5(IO_L13N_T2_MRCC_35) IC21.33(P2B13)
TX14_A: FPGA1.C2(IO_L19P_T3_35) IC21.12(P1B14)
TX14_B: FPGA1.A5(IO_L15N_T2_DQS_35) IC21.32(P2B14)
TX15_A: FPGA1.B1(IO_L21N_T3_DQS_35) IC21.11(P1B15)
TX15_B: FPGA1.B5(IO_L15P_T2_DQS_35) IC21.31(P2B15)
VINA_N: IC20.13(Ain2-)
VINA_P: IC20.12(Ain2+)
VINB_N: IC20.5(Ain1-)
VINB_P: IC20.4(Ain1+)
NetC334_2: C334.2 C336.1 IC20.7(REFH) IC20.9(REFH)
NetC335_1: C335.1 C336.2 IC20.8(REFL) IC20.10(REFL)
NetC337_1: C337.1 IC20.2(VCM1)
NetC338_2: C338.2 IC20.62(VREF)
NetC339_2: C339.2 IC20.15(VCM2)
NetC340_1: C340.1 IC21.58(REFIO)
NetC341_1: C341.1 C342.2 IC21.2(LPF)
NetIC20_63: IC20.63(SENSE) R179.2 R180.1
NetIC21_59: IC21.59(FSADJ2) R181.1
NetIC21_60: IC21.60(FSADJ1) R182.1

Not connected (* = marked no-connect by the designer): FPGA1 J14(IO_L2P_T0_AD8P_15) J15(IO_L2N_T0_AD8N_15) J16(IO_L1N_T0_AD0N_15) K6(IO_L10N_T1_AD15N_35) K15(IO_L1P_T0_AD0P_15) K16(IO_L3P_T0_DQS_AD1P_15) K17(IO_L3N_T0_DQS_AD1N_15) L17(IO_L8P_T1_AD10P_15) L18(IO_L8N_T1_AD10N_15) M14(IO_L4P_T0_15) M17(IO_L6N_T0_VREF_15)

### Layout directives
net class Power: 1V8, AGND_ADC, AGND_TX, AVDD_ADC, AVDD_TX, DVDD_ADC, DVDD_TX, GND
differential pair: ADC_CLK_OUT_N, ADC_CLK_OUT_P, CLK_ADC_N, CLK_ADC_P, IOUTA_N, IOUTA_P, IOUTB_N, IOUTB_P, VINA_N, VINA_P, VINB_N, VINB_P

### Notes on the sheet
- (near FPGA1) Bank 15 Powered by 1.8V VCC!
- TIE SENSE TO VDD FOR 2V RANGE;
  TIE SENSE TO GND FOR 1V RANGE;
- ADC work in Parallel Mode Operation (PAR/SER = Vdd).
  SDI/SDO = 00 (Normal Mode Operation)
  CS = 0 (Clock Duty Cycle Stabilizer Off)
  SCK = 0 ( Full-Rate CMOS Output Mode)
  FIXME!!!
- Подп. и дата
- Инв. № дубл.
- Взам. инв. №
- Инв. № подл.
- Лист
- Изм.
- № докум.
- Подп.
- Дата
- Копировал
- Формат А3
- (in symbol AD9777, part A) CTRL
- (in symbol AD9777, part B) CH1
- (in symbol AD9777, part C) CH2
- (in symbol AD9777, part D) PWR
- (in symbol LTC2185, part A) CTRL
- (in symbol LTC2185, part B) A
- (in symbol LTC2185, part C) B
- (in symbol LTC2185, part D) PWR
- (in symbol XC7A200T-2FBG676C, part D) BANK 15
- (in symbol XC7A200T-2FBG676C, part E) BANK 16

### Library data of the parts
C305 C310 C315 C316 C318-C320 C325 = Cer Cap: as C263 on sheet Clocking; PackageReference: SMD Chip Capacitor; Package: 0603
C306-C309 C311-C314 C321-C324 C326 C327 C329-C335 C337 C339 C341 C342 = Cer Cap: as C260 on sheet JTAG; PackageReference: SMD Chip Capacitor; Package: 0402
C317 C328 = Cap uF: as C295 on sheet Clocking; Package: C1210; PackageDescription: SMD Chip Capacitor
C336 C338 = Cer Cap: Cer Cap Small; Manufacturer: Murata; Material: x7r; Voltage: 10V; Tolerance: 10%; Type: Ceramic; PackageReference: SMD Chip Capacitor; Package: 0402
C340 = Cer Cap: Cer Cap Small; Manufacturer: Murata; Material: x7r; Voltage: 16V; Tolerance: 10%; Type: Ceramic; PackageReference: SMD Chip Capacitor; Package: 0402
FPGA1 = XC7A200T-2FBG676C: as FPGA1 on sheet JTAG; DatasheetVersion: v1.12; PackageVersion: Rev 1.8; PackageReference: FBG676; PackageDescription: Flip-Chip Lidless BGA, Body 27 x 27 mm, 1.0 mm Pitch; Supplier 1: Digi-Key; Supplier Part Number 1: 122-1865-ND; CLBs (Max Distributed RAM Kb): 2888; Generic Part Number: XC7A200T; RoHS: Pb-Free; NexusDeviceID: XC7A200T-2FBG676C; Mounting Technology: Surface Mount; Code_JEDEC: MS-034; PartNumber: XC7A200T-2FBG676C; ComponentLink1Description: Manufacturer URL; ComponentLink1URL: http://www.xilinx.com/; ComponentLink2Description: Datasheet; ComponentLink2URL: http://www.xilinx.com/support/documentation/data_sheets/ds180_7Series_Overview.pdf; ComponentLink3Description: Package Specification; ComponentLink3URL: http://www.xilinx.com/support/documentation/user_guides/ug475_7Series_Pkg_Pinout.pdf; ComponentLink4Description: DC and Switching Characteristics; ComponentLink4URL: http://www.xilinx.com/support/documentation/data_sheets/ds181_Artix_7_Data_Sheet.pdf; ComponentLink5Description: Package File; ComponentLink5URL: http://www.xilinx.com/support/packagefiles/a7packages/xc7a200tfbg676pkg.txt; ComponentLink6Description: Packaging and Pinout; ComponentLink6URL: http://www.xilinx.com/support/documentation/user_guides/ug475_7Series_Pkg_Pinout.pdf
IC20 = LTC2185: Dual 16-Bit, 125Msps  Low Power 3V ADC; Name: LTC2185CUP#PBF-ND; Power Dissipation: 370mW; Voltage: Single 1.8V Supply; Resolution: 16 Bits; Sampling Frequency: 125 MHz; Type: Dual 16-Bit, 105Msps  Low Power 3V ADC; Temperature Range: 0°C to 70°C; Package: 64-Pin (9mm × 9mm) QFN
IC21 = AD9777: 16-Bit, 160 MSPS  D/A Converter; Name: AD9777BSV; Power Dissipation: typical 1.2 W @ 3.3 V; Voltage: Single 3.3 V; Resolution: 16 bit; Sampling Frequency: 160 MHz; Type: 16-Bit, 160 MSPS 2x/4x/8x Interpolating Dual TxDAC+® D/A Converter; Temperature Range: −40°C to +85°C; Package: 80-pin TQFP
J4 = JMP: as J1 on sheet DB
L34 L35 = Inductor_LF: as L25 on sheet DB; Package: 1210; PackageDescription: Chip Inductor; Temperature Range: -25…85; Series: LQH
R175-R181 = Res: Resistor; Name: Chip SMD Resistor; Tolerance: 5%; Power: 0.062 Wt; Package: SMD; Temperature Range: -55…155
R182 = Res: Resistor; Name: Chip SMD Resistor; Power: 0.062 Wt; Package: SMD; Temperature Range: -55…155

## Sheet RAM&GPIO.SchDoc: {Наименование}
size 420 x 297 mm; DocumentNumber: ПЛАС.ХХХХХХ.ХХХ ХХ; SheetNumber: 9; SheetTotal: 11; PageSetup: Record=PageOptions|CenterHorizontal=False|CenterVertical=False|PrintScale=0.95|XCorrection=0.00|YCorrection=0.00|PrintKind=1|BorderSize=5000000|LeftOffset=0|BottomOffset=0|Orientation=1|PaperLength=1000|PaperWidth=1000|Scale=100|PaperSource=15|PrintQuality=600|MediaType=1|DitherType=10|PaperKind=A4|PrintScaleMode=1; Rule: PcbType=ProtelPcb
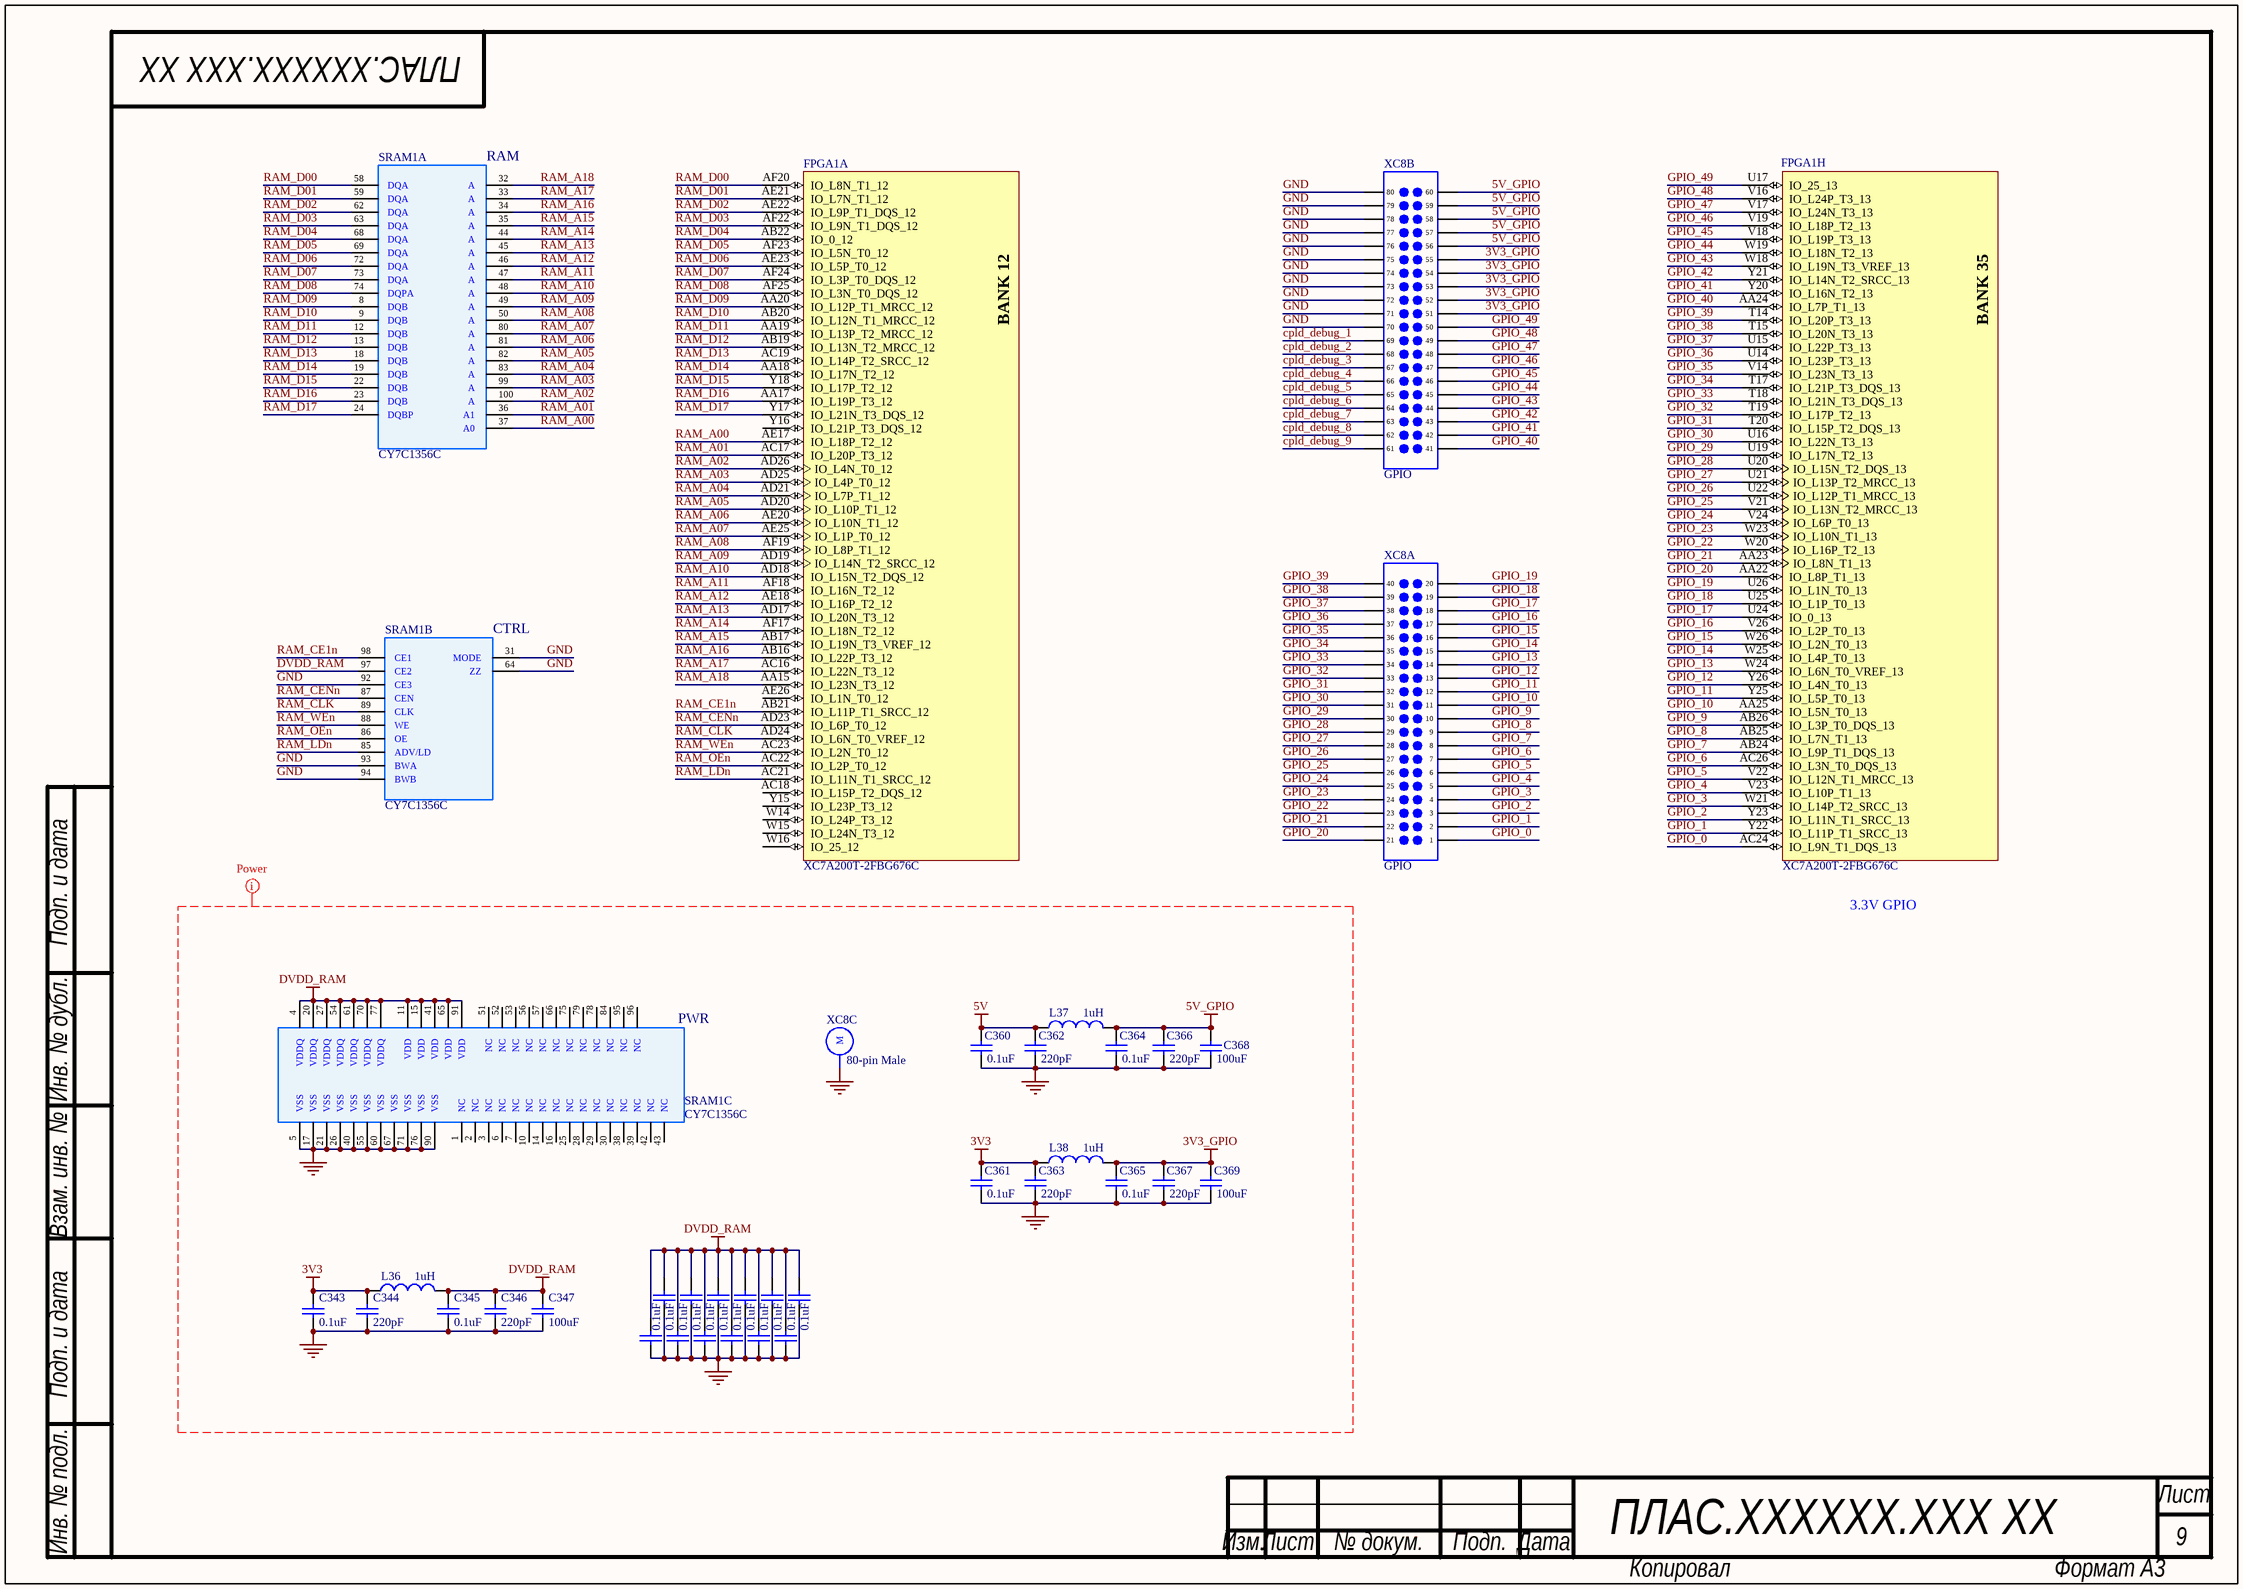
[diagram p8: RAM&GPIO.SchDoc]

### Parts
C343  value 0.1uF  [C0603]  (hidden comment: Cap)
C344  value 220pF  [C0603]  (hidden comment: Cap)
C345  value 0.1uF  [C0603]  (hidden comment: Cap)
C346  value 220pF  [C0603]  (hidden comment: Cap)
C347  value 100uF  [C1210]  (hidden comment: Cap)
C348  value 0.1uF  [С0402]  (hidden comment: Cap)
C349  value 0.1uF  [С0402]  (hidden comment: Cap)
C350  value 0.1uF  [С0402]  (hidden comment: Cap)
C351  value 0.1uF  [С0402]  (hidden comment: Cap)
C352  value 0.1uF  [С0402]  (hidden comment: Cap)
C353  value 0.1uF  [С0402]  (hidden comment: Cap)
C354  value 0.1uF  [С0402]  (hidden comment: Cap)
C355  value 0.1uF  [С0402]  (hidden comment: Cap)
C356  value 0.1uF  [С0402]  (hidden comment: Cap)
C357  value 0.1uF  [С0402]  (hidden comment: Cap)
C358  value 0.1uF  [С0402]  (hidden comment: Cap)
C359  value 0.1uF  [С0402]  (hidden comment: Cap)
C360  value 0.1uF  [C0603]  (hidden comment: Cap)
C361  value 0.1uF  [C0603]  (hidden comment: Cap)
C362  value 220pF  [C0603]  (hidden comment: Cap)
C363  value 220pF  [C0603]  (hidden comment: Cap)
C364  value 0.1uF  [C0603]  (hidden comment: Cap)
C365  value 0.1uF  [C0603]  (hidden comment: Cap)
C366  value 220pF  [C0603]  (hidden comment: Cap)
C367  value 220pF  [C0603]  (hidden comment: Cap)
C368  value 100uF  [C1210]  (hidden comment: Cap)
C369  value 100uF  [C1210]  (hidden comment: Cap)
FPGA1  XC7A200T-2FBG676C  [FGG676]  (parts A,H of 14)
L36  value 1uH  [L1210_Murata]  (hidden comment: Inductor_LF)
L37  value 1uH  [L1210_Murata LQH]  (hidden comment: Inductor_LF)
L38  value 1uH  [L1210_Murata LQH]  (hidden comment: Inductor_LF)
SRAM1  CY7C1356C  [TQFP-100]  (parts A,B,C of 3)
XC8  GPIO  [Molex_465572545]  (parts A,B,C of 3)

### Nets
3V3: C343.1 C344.1 C361.1 C363.1 L36.2 L38.2
3V3_GPIO: C365.1 C367.1 C369.2 L38.1 XC8.51 XC8.52 XC8.53 XC8.54 XC8.55
5V: C360.1 C362.1 L37.2
5V_GPIO: C364.1 C366.1 C368.1 L37.1 XC8.56 XC8.57 XC8.58 XC8.59 XC8.60
DVDD_RAM: C345.1 C346.1 C347.2 C348.2 C349.2 C350.2 C351.2 C352.2 C353.2 C354.2 C355.2 C356.2 C357.2 C358.2 C359.2 L36.1 SRAM1.4(VDDQ) SRAM1.11(VDD) SRAM1.15(VDD) SRAM1.20(VDDQ) SRAM1.27(VDDQ) SRAM1.41(VDD) SRAM1.54(VDDQ) SRAM1.61(VDDQ) SRAM1.65(VDD) SRAM1.70(VDDQ) SRAM1.77(VDDQ) SRAM1.91(VDD) SRAM1.97(CE2)
GND: C343.2 C344.2 C345.2 C346.2 C347.1 C348.1 C349.1 C350.1 C351.1 C352.1 C353.1 C354.1 C355.1 C356.1 C357.1 C358.1 C359.1 C360.2 C361.2 C362.2 C363.2 C364.2 C365.2 C366.2 C367.2 C368.2 C369.1 SRAM1.5(VSS) SRAM1.17(VSS) SRAM1.21(VSS) SRAM1.26(VSS) SRAM1.31(MODE) SRAM1.40(VSS) SRAM1.55(VSS) SRAM1.60(VSS) SRAM1.64(ZZ) SRAM1.67(VSS) SRAM1.71(VSS) SRAM1.76(VSS) SRAM1.90(VSS) SRAM1.92(CE3) SRAM1.93(BWA) SRAM1.94(BWB) XC8.0(M) XC8.70 XC8.71 XC8.72 XC8.73 XC8.74 XC8.75 XC8.76 XC8.77 XC8.78 XC8.79 XC8.80
cpld_debug_1: XC8.69
cpld_debug_2: XC8.68
cpld_debug_3: XC8.67
cpld_debug_4: XC8.66
cpld_debug_5: XC8.65
cpld_debug_6: XC8.64
cpld_debug_7: XC8.63
cpld_debug_8: XC8.62
cpld_debug_9: XC8.61
GPIO_0: FPGA1.AC24(IO_L9N_T1_DQS_13) XC8.1
GPIO_1: FPGA1.Y22(IO_L11P_T1_SRCC_13) XC8.2
GPIO_2: FPGA1.Y23(IO_L11N_T1_SRCC_13) XC8.3
GPIO_3: FPGA1.W21(IO_L14P_T2_SRCC_13) XC8.4
GPIO_4: FPGA1.V23(IO_L10P_T1_13) XC8.5
GPIO_5: FPGA1.V22(IO_L12N_T1_MRCC_13) XC8.6
GPIO_6: FPGA1.AC26(IO_L3N_T0_DQS_13) XC8.7
GPIO_7: FPGA1.AB24(IO_L9P_T1_DQS_13) XC8.8
GPIO_8: FPGA1.AB25(IO_L7N_T1_13) XC8.9
GPIO_9: FPGA1.AB26(IO_L3P_T0_DQS_13) XC8.10
GPIO_10: FPGA1.AA25(IO_L5N_T0_13) XC8.11
GPIO_11: FPGA1.Y25(IO_L5P_T0_13) XC8.12
GPIO_12: FPGA1.Y26(IO_L4N_T0_13) XC8.13
GPIO_13: FPGA1.W24(IO_L6N_T0_VREF_13) XC8.14
GPIO_14: FPGA1.W25(IO_L4P_T0_13) XC8.15
GPIO_15: FPGA1.W26(IO_L2N_T0_13) XC8.16
GPIO_16: FPGA1.V26(IO_L2P_T0_13) XC8.17
GPIO_17: FPGA1.U24(IO_0_13) XC8.18
GPIO_18: FPGA1.U25(IO_L1P_T0_13) XC8.19
GPIO_19: FPGA1.U26(IO_L1N_T0_13) XC8.20
GPIO_20: FPGA1.AA22(IO_L8P_T1_13) XC8.21
GPIO_21: FPGA1.AA23(IO_L8N_T1_13) XC8.22
GPIO_22: FPGA1.W20(IO_L16P_T2_13) XC8.23
GPIO_23: FPGA1.W23(IO_L10N_T1_13) XC8.24
GPIO_24: FPGA1.V24(IO_L6P_T0_13) XC8.25
GPIO_25: FPGA1.V21(IO_L13N_T2_MRCC_13) XC8.26
GPIO_26: FPGA1.U22(IO_L12P_T1_MRCC_13) XC8.27
GPIO_27: FPGA1.U21(IO_L13P_T2_MRCC_13) XC8.28
GPIO_28: FPGA1.U20(IO_L15N_T2_DQS_13) XC8.29
GPIO_29: FPGA1.U19(IO_L17N_T2_13) XC8.30
GPIO_30: FPGA1.U16(IO_L22N_T3_13) XC8.31
GPIO_31: FPGA1.T20(IO_L15P_T2_DQS_13) XC8.32
GPIO_32: FPGA1.T19(IO_L17P_T2_13) XC8.33
GPIO_33: FPGA1.T18(IO_L21N_T3_DQS_13) XC8.34
GPIO_34: FPGA1.T17(IO_L21P_T3_DQS_13) XC8.35
GPIO_35: FPGA1.V14(IO_L23N_T3_13) XC8.36
GPIO_36: FPGA1.U14(IO_L23P_T3_13) XC8.37
GPIO_37: FPGA1.U15(IO_L22P_T3_13) XC8.38
GPIO_38: FPGA1.T15(IO_L20N_T3_13) XC8.39
GPIO_39: FPGA1.T14(IO_L20P_T3_13) XC8.40
GPIO_40: FPGA1.AA24(IO_L7P_T1_13) XC8.41
GPIO_41: FPGA1.Y20(IO_L16N_T2_13) XC8.42
GPIO_42: FPGA1.Y21(IO_L14N_T2_SRCC_13) XC8.43
GPIO_43: FPGA1.W18(IO_L19N_T3_VREF_13) XC8.44
GPIO_44: FPGA1.W19(IO_L18N_T2_13) XC8.45
GPIO_45: FPGA1.V18(IO_L19P_T3_13) XC8.46
GPIO_46: FPGA1.V19(IO_L18P_T2_13) XC8.47
GPIO_47: FPGA1.V17(IO_L24N_T3_13) XC8.48
GPIO_48: FPGA1.V16(IO_L24P_T3_13) XC8.49
GPIO_49: FPGA1.U17(IO_25_13) XC8.50
RAM_A00: FPGA1.AE17(IO_L18P_T2_12) SRAM1.37(A0)
RAM_A01: FPGA1.AC17(IO_L20P_T3_12) SRAM1.36(A1)
RAM_A02: FPGA1.AD26(IO_L4N_T0_12) SRAM1.100(A)
RAM_A03: FPGA1.AD25(IO_L4P_T0_12) SRAM1.99(A)
RAM_A04: FPGA1.AD21(IO_L7P_T1_12) SRAM1.83(A)
RAM_A05: FPGA1.AD20(IO_L10P_T1_12) SRAM1.82(A)
RAM_A06: FPGA1.AE20(IO_L10N_T1_12) SRAM1.81(A)
RAM_A07: FPGA1.AE25(IO_L1P_T0_12) SRAM1.80(A)
RAM_A08: FPGA1.AF19(IO_L8P_T1_12) SRAM1.50(A)
RAM_A09: FPGA1.AD19(IO_L14N_T2_SRCC_12) SRAM1.49(A)
RAM_A10: FPGA1.AD18(IO_L15N_T2_DQS_12) SRAM1.48(A)
RAM_A11: FPGA1.AF18(IO_L16N_T2_12) SRAM1.47(A)
RAM_A12: FPGA1.AE18(IO_L16P_T2_12) SRAM1.46(A)
RAM_A13: FPGA1.AD17(IO_L20N_T3_12) SRAM1.45(A)
RAM_A14: FPGA1.AF17(IO_L18N_T2_12) SRAM1.44(A)
RAM_A15: FPGA1.AB17(IO_L19N_T3_VREF_12) SRAM1.35(A)
RAM_A16: FPGA1.AB16(IO_L22P_T3_12) SRAM1.34(A)
RAM_A17: FPGA1.AC16(IO_L22N_T3_12) SRAM1.33(A)
RAM_A18: FPGA1.AA15(IO_L23N_T3_12) SRAM1.32(A)
RAM_CE1n: FPGA1.AB21(IO_L11P_T1_SRCC_12) SRAM1.98(CE1)
RAM_CENn: FPGA1.AD23(IO_L6P_T0_12) SRAM1.87(CEN)
RAM_CLK: FPGA1.AD24(IO_L6N_T0_VREF_12) SRAM1.89(CLK)
RAM_D00: FPGA1.AF20(IO_L8N_T1_12) SRAM1.58(DQA)
RAM_D01: FPGA1.AE21(IO_L7N_T1_12) SRAM1.59(DQA)
RAM_D02: FPGA1.AE22(IO_L9P_T1_DQS_12) SRAM1.62(DQA)
RAM_D03: FPGA1.AF22(IO_L9N_T1_DQS_12) SRAM1.63(DQA)
RAM_D04: FPGA1.AB22(IO_0_12) SRAM1.68(DQA)
RAM_D05: FPGA1.AF23(IO_L5N_T0_12) SRAM1.69(DQA)
RAM_D06: FPGA1.AE23(IO_L5P_T0_12) SRAM1.72(DQA)
RAM_D07: FPGA1.AF24(IO_L3P_T0_DQS_12) SRAM1.73(DQA)
RAM_D08: FPGA1.AF25(IO_L3N_T0_DQS_12) SRAM1.74(DQPA)
RAM_D09: FPGA1.AA20(IO_L12P_T1_MRCC_12) SRAM1.8(DQB)
RAM_D10: FPGA1.AB20(IO_L12N_T1_MRCC_12) SRAM1.9(DQB)
RAM_D11: FPGA1.AA19(IO_L13P_T2_MRCC_12) SRAM1.12(DQB)
RAM_D12: FPGA1.AB19(IO_L13N_T2_MRCC_12) SRAM1.13(DQB)
RAM_D13: FPGA1.AC19(IO_L14P_T2_SRCC_12) SRAM1.18(DQB)
RAM_D14: FPGA1.AA18(IO_L17N_T2_12) SRAM1.19(DQB)
RAM_D15: FPGA1.Y18(IO_L17P_T2_12) SRAM1.22(DQB)
RAM_D16: FPGA1.AA17(IO_L19P_T3_12) SRAM1.23(DQB)
RAM_D17: FPGA1.Y17(IO_L21N_T3_DQS_12) SRAM1.24(DQBP)
RAM_LDn: FPGA1.AC21(IO_L11N_T1_SRCC_12) SRAM1.85(ADV/LD)
RAM_OEn: FPGA1.AC22(IO_L2P_T0_12) SRAM1.86(OE)
RAM_WEn: FPGA1.AC23(IO_L2N_T0_12) SRAM1.88(WE)

Not connected (* = marked no-connect by the designer): FPGA1 AC18(IO_L15P_T2_DQS_12) AE26(IO_L1N_T0_12) W14(IO_L24P_T3_12) W15(IO_L24N_T3_12) W16(IO_25_12) Y15(IO_L23P_T3_12) Y16(IO_L21P_T3_DQS_12); SRAM1 1(NC) 2(NC) 3(NC) 6(NC) 7(NC) 10(NC) 14(NC) 16(NC) 25(NC) 28(NC) 29(NC) 30(NC) 38(NC) 39(NC) 42(NC) 43(NC) 51(NC) 52(NC) 53(NC) 56(NC) 57(NC) 66(NC) 75(NC) 78(NC) 79(NC) 84(NC) 95(NC) 96(NC)

### Layout directives
net class Power: 3V3, 3V3_GPIO, 5V, 5V_GPIO, DVDD_RAM, GND

### Notes on the sheet
- 3.3V GPIO
- Подп. и дата
- Инв. № дубл.
- Взам. инв. №
- Инв. № подл.
- Лист
- Изм.
- № докум.
- Подп.
- Дата
- Копировал
- Формат А3
- (in symbol CY7C1356C, part A) RAM
- (in symbol CY7C1356C, part B) CTRL
- (in symbol CY7C1356C, part C) PWR
- (in symbol XC7A200T-2FBG676C, part A) BANK 12
- (in symbol XC7A200T-2FBG676C, part H) BANK 35

### Library data of the parts
C343-C346 C360-C367 = Cer Cap: Cer Cap Small; Manufacturer: Murata; Material: x5r; Voltage: 16V; Tolerance: 10%; Type: Ceramic; PackageReference: SMD Chip Capacitor; Package: 0603
C347 C368 C369 = Cap uF: Cer Cap Large; Manufacturer: Murata; Material: x5r; Tolerance: 20%; Voltage: 6.3V; Type: Ceramic; Package: C1210; PackageDescription: SMD Chip Capacitor
C348-C359 = Cer Cap: Cer Cap Small; Manufacturer: Murata; Material: x7r; Voltage: 50V; Tolerance: 10%; Type: Ceramic; PackageReference: SMD Chip Capacitor; Package: 0402
FPGA1 = XC7A200T-2FBG676C: Artix-7 FPGA, 400 User I/Os, 8 GTP, 676-Ball BGA, Speed Grade 2, Commercial Grade, Pb-Free; Manufacturer: Xilinx; Block RAM Blocks (18Kb): 730; Block RAM Blocks (36Kb): 365; Block RAM Blocks (Max Kb): 13140; CLBs (Slices): 33650; Clock Mgmt Tiles (CMTs): 10; DSP48E1 Slices: 740; Logic Cells: 215360; Max User I/O: 500; Speed Grade: -2; DatasheetVersion: v1.12; PackageVersion: Rev 1.8; PackageReference: FBG676; PackageDescription: Flip-Chip Lidless BGA, Body 27 x 27 mm, 1.0 mm Pitch; Supplier 1: Digi-Key; Supplier Part Number 1: 122-1865-ND; CLBs (Max Distributed RAM Kb): 2888; Generic Part Number: XC7A200T; RoHS: Pb-Free; NexusDeviceID: XC7A200T-2FBG676C; Mounting Technology: Surface Mount; Code_JEDEC: MS-034; PartNumber: XC7A200T-2FBG676C; ComponentLink1Description: Manufacturer URL; ComponentLink1URL: http://www.xilinx.com/; ComponentLink2Description: Datasheet; ComponentLink2URL: http://www.xilinx.com/support/documentation/data_sheets/ds180_7Series_Overview.pdf; ComponentLink3Description: Package Specification; ComponentLink3URL: http://www.xilinx.com/support/documentation/user_guides/ug475_7Series_Pkg_Pinout.pdf; ComponentLink4Description: DC and Switching Characteristics; ComponentLink4URL: http://www.xilinx.com/support/documentation/data_sheets/ds181_Artix_7_Data_Sheet.pdf; ComponentLink5Description: Package File; ComponentLink5URL: http://www.xilinx.com/support/packagefiles/a7packages/xc7a200tfbg676pkg.txt; ComponentLink6Description: Packaging and Pinout; ComponentLink6URL: http://www.xilinx.com/support/documentation/user_guides/ug475_7Series_Pkg_Pinout.pdf
L36 = Inductor_LF: Inductor_Power_Lines; Manufacturer: Murata; Name: LQM32PN1R0MG0; Tolerance: 5%; Current: 1800mA; Frequency: 60MHz; Package: 1210; PackageDescription: Chip Inductor; Temperature Range: -25…85; Series: LQM
L37 L38 = Inductor_LF: Inductor_Power_Lines; Manufacturer: Murata; Name: LQH32PN1R0NNC; Tolerance: 5%; Current: 2500mA; Frequency: 100MHz; Package: 1210; PackageDescription: Chip Inductor; Temperature Range: -25…85; Series: LQH
SRAM1 = CY7C1356C: Pipelined SRAM with NoBL; Name: CY7C1356C-250AXC; Voltage: 3.3 V; Type: 9-Mbit (512 K × 18); Package: 100-pin TQFP (14 × 20 × 1.4 mm)
XC8 = Molex_SEARAY™ 46557: CONN FML 80POS 4ROWS GOLD SMD; Manufacturer: Molex; Name: High Density Array, Female; Pitch: 0.050" (1.27mm); Number of Positions: 80; P/N: 46557-2545; Mates With: SEARAY™ 46556 Series; Series: SEARAY™ 46557; Number of Rows: 4; Mounting Type: Surface Mount